# EAGLE schematic AP_AT42QT2120 (EAGLE 9.6.2)
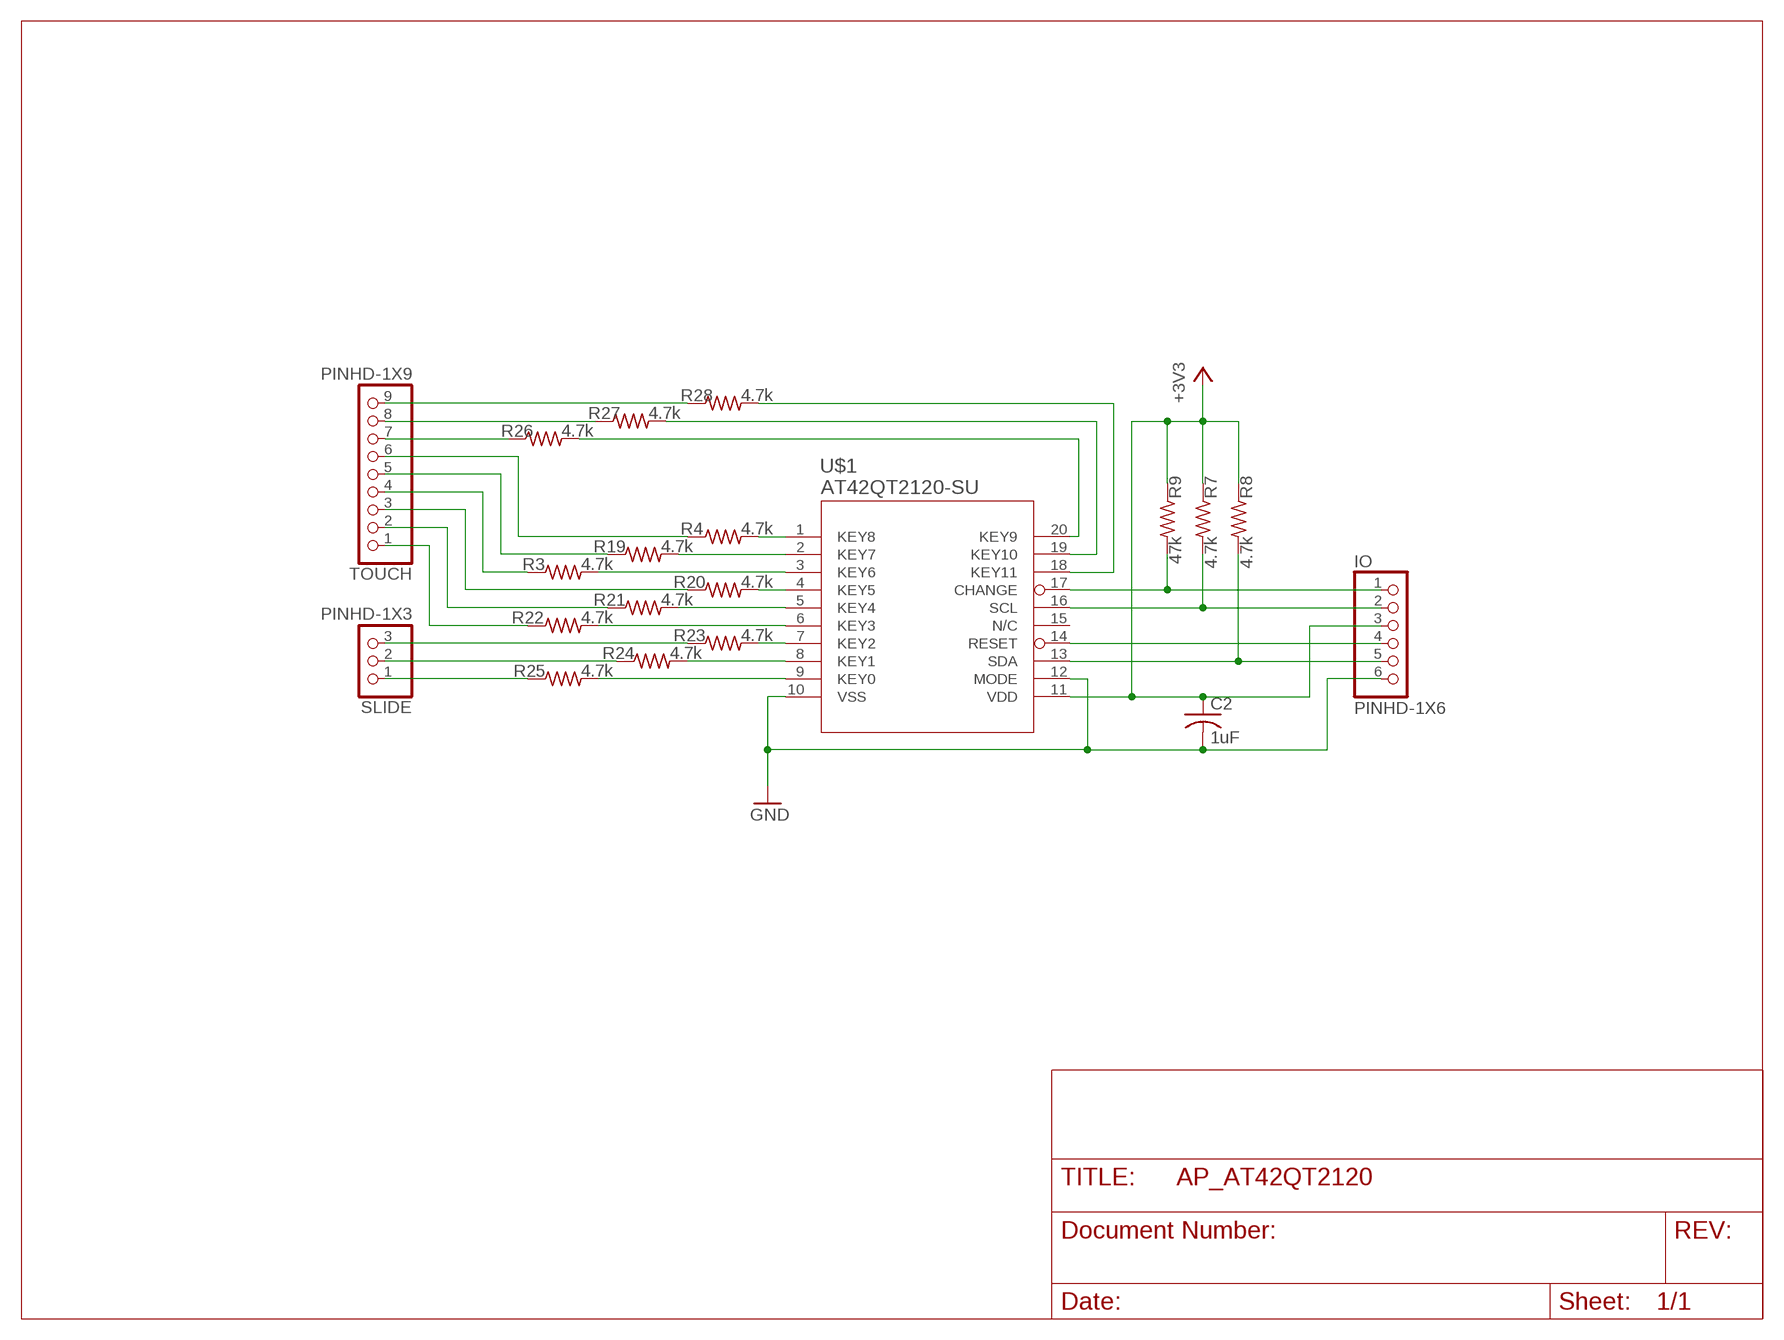
[diagram p0: schematic, sheet 1]

## Parts
C2  1uF  C-USC1206  [C1206]
IO  PINHD-1X6  [1X06]
R3  4.7k  R-US_R1206  [R1206]
R4  4.7k  R-US_R1206  [R1206]
R7  4.7k  R-US_R1206  [R1206]
R8  4.7k  R-US_R1206  [R1206]
R9  47k  R-US_R1206  [R1206]
R19  4.7k  R-US_R1206  [R1206]
R20  4.7k  R-US_R1206  [R1206]
R21  4.7k  R-US_R1206  [R1206]
R22  4.7k  R-US_R1206  [R1206]
R23  4.7k  R-US_R1206  [R1206]
R24  4.7k  R-US_R1206  [R1206]
R25  4.7k  R-US_R1206  [R1206]
R26  4.7k  R-US_R1206  [R1206]
R27  4.7k  R-US_R1206  [R1206]
R28  4.7k  R-US_R1206  [R1206]
SLIDE  PINHD-1X3  [1X03]
TOUCH  PINHD-1X9  [1X09]
U$1  AT42QT2120-SU  [SOIC20]

## Nets
+3V3: C2.1 IO.3 R7.1 R8.1 R9.1 U$1.11(VDD)
GND: C2.2 IO.6 U$1.10(VSS) U$1.12(MODE)
N$1: R4.2 U$1.1(KEY8)
N$2: R19.2 U$1.2(KEY7)
N$3: R3.2 U$1.3(KEY6)
N$4: R20.2 U$1.4(KEY5)
N$5: R21.2 U$1.5(KEY4)
N$6: R22.2 U$1.6(KEY3)
N$7: R23.2 U$1.7(KEY2)
N$8: R24.2 U$1.8(KEY1)
N$9: R25.2 U$1.9(KEY0)
N$10: R25.1 SLIDE.1
N$11: R24.1 SLIDE.2
N$12: R23.1 SLIDE.3
N$13: R22.1 TOUCH.1
N$14: R21.1 TOUCH.2
N$15: R20.1 TOUCH.3
N$16: R3.1 TOUCH.4
N$17: R19.1 TOUCH.5
N$18: R4.1 TOUCH.6
N$19: R26.1 TOUCH.7
N$20: R26.2 U$1.20(KEY9)
N$21: R27.1 TOUCH.8
N$22: R28.1 TOUCH.9
N$24: R27.2 U$1.19(KEY10)
N$25: IO.2 R7.2 U$1.16(SCL)
N$26: IO.1 R9.2 U$1.17(CHANGE)
N$27: IO.5 R8.2 U$1.13(SDA)
N$28: IO.4 U$1.14(RESET)
N$29: R28.2 U$1.18(KEY11)
Unconnected: U$1.15(N/C)

## Library data of the parts
C2 = rcl:C-US: CAPACITOR, American symbol; SPICEPREFIX: C
IO = Connector:PINHD-1X6: PIN HEADER; CATEGORY: CONNECTOR; SUB-CATEGORY: PIN-HEADER
R3 R4 R7-R9 R19-R28 = rcl:R-US_: RESISTOR, American symbol; SPICEPREFIX: R
SLIDE = Connector:PINHD-1X3: PIN HEADER; CATEGORY: CONNECTOR; SUB-CATEGORY: PIN-HEADER
TOUCH = Connector:PINHD-1X9: PIN HEADER; CATEGORY: CONNECTOR; SUB-CATEGORY: PIN-HEADER
U$1 = 2022-03-29_19-48-10_Library:AT42QT2120-SU: COMMS NAMES